# Altium schematic sheet PlacaBase_agus.SchDoc
size B; PageSetup: Record=PageOptions|CenterHorizontal=True|CenterVertical=True|PrintScale=1.00|XCorrection=1.00|YCorrection=1.00|PrintKind=1|BorderSize=5000000|LeftOffset=0|BottomOffset=0|Orientation=2|PaperLength=1000|PaperWidth=1000|Scale=100|PaperSource=7|PrintQuality=-4|MediaType=1|DitherType=10|PaperKind=A4|PrintScaleMode=1
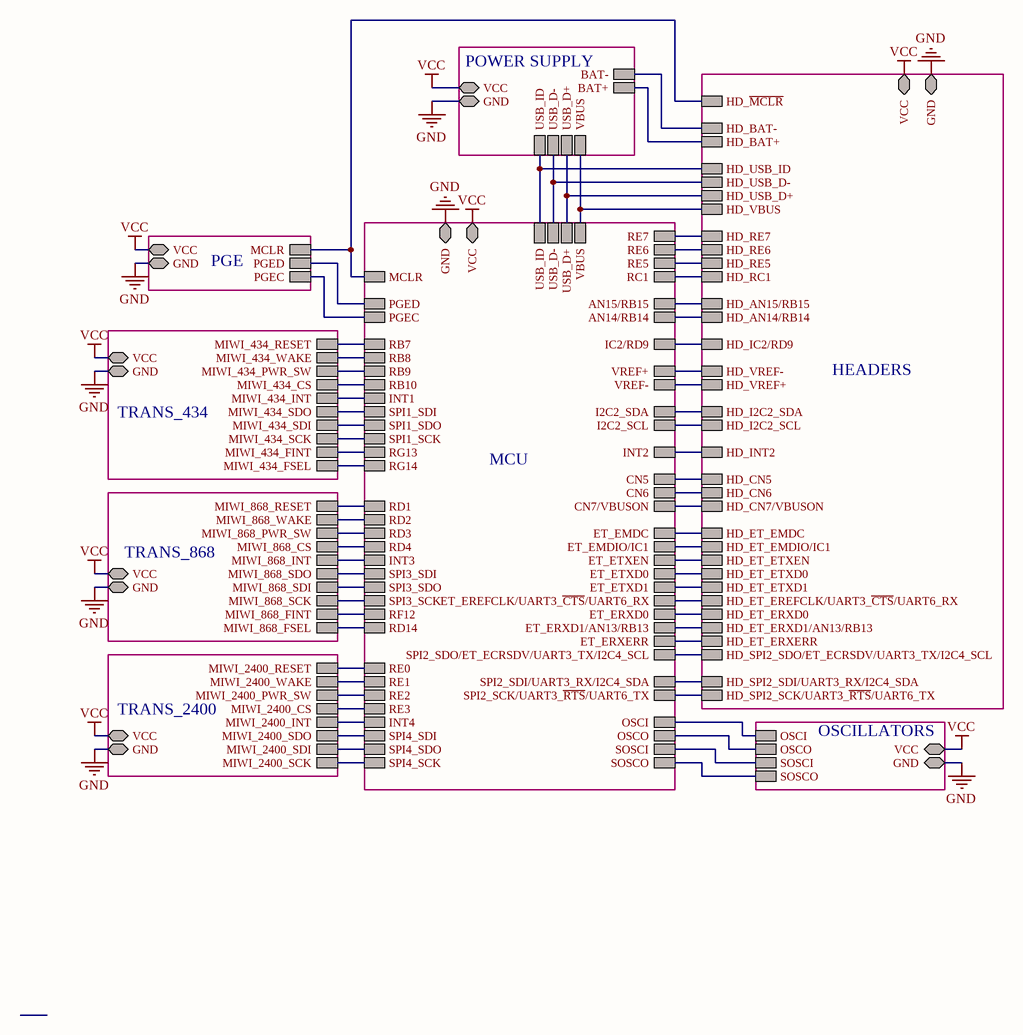
[diagram p0: PlacaBase_agus.SchDoc]

## Sub-sheets
HEADERS = headers.SchDoc: HD_RE5, HD_RE6, HD_RE7, HD_RC1, HD_AN15/RB15, HD_AN14/RB14, HD_INT2, HD_VREF+, HD_VREF-, HD_I2C2_SDA, HD_I2C2_SCL, HD_BAT+, HD_~{MCLR}, HD_CN6, HD_CN5, HD_CN7/VBUSON, HD_IC2/RD9, HD_BAT-, HD_USB_ID, HD_USB_D+, HD_USB_D-, HD_VBUS, HD_ET_EMDC, HD_ET_ETXEN, HD_ET_ETXD0, HD_ET_ETXD1, HD_ET_ERXD0, HD_ET_ERXERR, HD_SPI2_SCK/UART3_~{RTS}/UART6_TX, HD_SPI2_SDI/UART3_RX/I2C4_SDA, HD_SPI2_SDO/ET_ECRSDV/UART3_TX/I2C4_SCL, HD_ET_EREFCLK/UART3_~{CTS}/UART6_RX, HD_ET_EMDIO/IC1, HD_ET_ERXD1/AN13/RB13, VCC, GND
MCU = MCU.SchDoc: VBUS, PGED, PGEC, MCLR, SPI4_SDI, SPI4_SDO, SPI4_SCK, SPI1_SDO, SPI1_SDI, SPI1_SCK, SPI3_SCK, SPI3_SDI, SPI3_SDO, USB_ID, USB_D-, USB_D+, OSCI, OSCO, SOSCI, SOSCO, RE0, RE1, RE3, RB7, RD1, RB8, RD2, RB9, RD3, INT3, INT1, INT2, RB10, RD4, RE2, INT4, RE7, RE6, RE5, RC1, VREF-, VREF+, AN15/RB15, AN14/RB14, ET_ERXD1/AN13/RB13, I2C2_SCL, I2C2_SDA, CN7/VBUSON, CN6, CN5, ET_EMDIO/IC1, IC2/RD9, SPI2_SCK/UART3_~{RTS}/UART6_TX, SPI2_SDI/UART3_RX/I2C4_SDA, SPI2_SDO/ET_ECRSDV/UART3_TX/I2C4_SCL, ET_EREFCLK/UART3_~{CTS}/UART6_RX, ET_EMDC, ET_ETXEN, ET_ETXD0, ET_ETXD1, ET_ERXD0, ET_ERXERR, GND, VCC, RD14, RF12, RG13, RG14
OSCILLATORS = oscillators.SchDoc: OSCI, OSCO, SOSCI, SOSCO, VCC, GND
PGE = PGE.SchDoc: MCLR, PGED, PGEC, VCC, GND
POWER SUPPLY = power_supply.SchDoc: USB_ID, USB_D-, USB_D+, VBUS, BAT-, BAT+, GND, VCC
TRANS_434 = transc_MIWI434.SchDoc: MIWI_434_RESET, MIWI_434_WAKE, MIWI_434_INT, MIWI_434_SDI, MIWI_434_SCK, MIWI_434_CS, MIWI_434_SDO, MIWI_434_PWR_SW, VCC, GND, MIWI_434_FINT, MIWI_434_FSEL
TRANS_868 = transc_MIWI868.SchDoc: MIWI_868_RESET, MIWI_868_WAKE, MIWI_868_INT, MIWI_868_SDI, MIWI_868_SCK, MIWI_868_CS, MIWI_868_SDO, MIWI_868_PWR_SW, VCC, GND, MIWI_868_FINT, MIWI_868_FSEL
TRANS_2400 = transc_MIWI2400.SchDoc: MIWI_2400_RESET, MIWI_2400_WAKE, MIWI_2400_INT, MIWI_2400_SDI, MIWI_2400_SCK, MIWI_2400_CS, MIWI_2400_SDO, MIWI_2400_PWR_SW, VCC, GND

## Nets
GND: sheet PGE/GND, sheet OSCILLATORS/GND, sheet HEADERS/GND, sheet TRANS_434/GND, sheet TRANS_868/GND, sheet TRANS_2400/GND, sheet POWER SUPPLY/GND, sheet MCU/GND
VCC: sheet PGE/VCC, sheet OSCILLATORS/VCC, sheet HEADERS/VCC, sheet TRANS_434/VCC, sheet TRANS_868/VCC, sheet TRANS_2400/VCC, sheet POWER SUPPLY/VCC, sheet MCU/VCC
(unnamed): sheet PGE/MCLR, sheet HEADERS/HD_~{MCLR}, sheet MCU/MCLR
(unnamed): sheet PGE/PGED, sheet MCU/PGED
(unnamed): sheet PGE/PGEC, sheet MCU/PGEC
(unnamed): sheet OSCILLATORS/OSCI, sheet MCU/OSCI
(unnamed): sheet OSCILLATORS/OSCO, sheet MCU/OSCO
(unnamed): sheet OSCILLATORS/SOSCI, sheet MCU/SOSCI
(unnamed): sheet OSCILLATORS/SOSCO, sheet MCU/SOSCO
(unnamed): sheet HEADERS/HD_RE5, sheet MCU/RE5
(unnamed): sheet HEADERS/HD_RE6, sheet MCU/RE6
(unnamed): sheet HEADERS/HD_RE7, sheet MCU/RE7
(unnamed): sheet HEADERS/HD_RC1, sheet MCU/RC1
(unnamed): sheet HEADERS/HD_AN15/RB15, sheet MCU/AN15/RB15
(unnamed): sheet HEADERS/HD_AN14/RB14, sheet MCU/AN14/RB14
(unnamed): sheet HEADERS/HD_INT2, sheet MCU/INT2
(unnamed): sheet HEADERS/HD_VREF+, sheet MCU/VREF-
(unnamed): sheet HEADERS/HD_VREF-, sheet MCU/VREF+
(unnamed): sheet HEADERS/HD_I2C2_SDA, sheet MCU/I2C2_SDA
(unnamed): sheet HEADERS/HD_I2C2_SCL, sheet MCU/I2C2_SCL
(unnamed): sheet HEADERS/HD_BAT+, sheet POWER SUPPLY/BAT+
(unnamed): sheet HEADERS/HD_CN6, sheet MCU/CN6
(unnamed): sheet HEADERS/HD_CN5, sheet MCU/CN5
(unnamed): sheet HEADERS/HD_CN7/VBUSON, sheet MCU/CN7/VBUSON
(unnamed): sheet HEADERS/HD_IC2/RD9, sheet MCU/IC2/RD9
(unnamed): sheet HEADERS/HD_BAT-, sheet POWER SUPPLY/BAT-
(unnamed): sheet HEADERS/HD_USB_ID, sheet POWER SUPPLY/USB_ID, sheet MCU/USB_ID
(unnamed): sheet HEADERS/HD_USB_D+, sheet POWER SUPPLY/USB_D+, sheet MCU/USB_D+
(unnamed): sheet HEADERS/HD_USB_D-, sheet POWER SUPPLY/USB_D-, sheet MCU/USB_D-
(unnamed): sheet HEADERS/HD_VBUS, sheet POWER SUPPLY/VBUS, sheet MCU/VBUS
(unnamed): sheet HEADERS/HD_ET_EMDC, sheet MCU/ET_EMDC
(unnamed): sheet HEADERS/HD_ET_ETXEN, sheet MCU/ET_ETXEN
(unnamed): sheet HEADERS/HD_ET_ETXD0, sheet MCU/ET_ETXD0
(unnamed): sheet HEADERS/HD_ET_ETXD1, sheet MCU/ET_ETXD1
(unnamed): sheet HEADERS/HD_ET_ERXD0, sheet MCU/ET_ERXD0
(unnamed): sheet HEADERS/HD_ET_ERXERR, sheet MCU/ET_ERXERR
(unnamed): sheet HEADERS/HD_SPI2_SCK/UART3_~{RTS}/UART6_TX, sheet MCU/SPI2_SCK/UART3_~{RTS}/UART6_TX
(unnamed): sheet HEADERS/HD_SPI2_SDI/UART3_RX/I2C4_SDA, sheet MCU/SPI2_SDI/UART3_RX/I2C4_SDA
(unnamed): sheet HEADERS/HD_SPI2_SDO/ET_ECRSDV/UART3_TX/I2C4_SCL, sheet MCU/SPI2_SDO/ET_ECRSDV/UART3_TX/I2C4_SCL
(unnamed): sheet HEADERS/HD_ET_EREFCLK/UART3_~{CTS}/UART6_RX, sheet MCU/ET_EREFCLK/UART3_~{CTS}/UART6_RX
(unnamed): sheet HEADERS/HD_ET_EMDIO/IC1, sheet MCU/ET_EMDIO/IC1
(unnamed): sheet HEADERS/HD_ET_ERXD1/AN13/RB13, sheet MCU/ET_ERXD1/AN13/RB13
(unnamed): sheet TRANS_434/MIWI_434_RESET, sheet MCU/RB7
(unnamed): sheet TRANS_434/MIWI_434_WAKE, sheet MCU/RB8
(unnamed): sheet TRANS_434/MIWI_434_INT, sheet MCU/INT1
(unnamed): sheet TRANS_434/MIWI_434_SDI, sheet MCU/SPI1_SDO
(unnamed): sheet TRANS_434/MIWI_434_SCK, sheet MCU/SPI1_SCK
(unnamed): sheet TRANS_434/MIWI_434_CS, sheet MCU/RB10
(unnamed): sheet TRANS_434/MIWI_434_SDO, sheet MCU/SPI1_SDI
(unnamed): sheet TRANS_434/MIWI_434_PWR_SW, sheet MCU/RB9
(unnamed): sheet TRANS_434/MIWI_434_FINT, sheet MCU/RG13
(unnamed): sheet TRANS_434/MIWI_434_FSEL, sheet MCU/RG14
(unnamed): sheet TRANS_868/MIWI_868_RESET, sheet MCU/RD1
(unnamed): sheet TRANS_868/MIWI_868_WAKE, sheet MCU/RD2
(unnamed): sheet TRANS_868/MIWI_868_INT, sheet MCU/INT3
(unnamed): sheet TRANS_868/MIWI_868_SDI, sheet MCU/SPI3_SDO
(unnamed): sheet TRANS_868/MIWI_868_SCK, sheet MCU/SPI3_SCK
(unnamed): sheet TRANS_868/MIWI_868_CS, sheet MCU/RD4
(unnamed): sheet TRANS_868/MIWI_868_SDO, sheet MCU/SPI3_SDI
(unnamed): sheet TRANS_868/MIWI_868_PWR_SW, sheet MCU/RD3
(unnamed): sheet TRANS_868/MIWI_868_FINT, sheet MCU/RF12
(unnamed): sheet TRANS_868/MIWI_868_FSEL, sheet MCU/RD14
(unnamed): sheet TRANS_2400/MIWI_2400_RESET, sheet MCU/RE0
(unnamed): sheet TRANS_2400/MIWI_2400_WAKE, sheet MCU/RE1
(unnamed): sheet TRANS_2400/MIWI_2400_INT, sheet MCU/INT4
(unnamed): sheet TRANS_2400/MIWI_2400_SDI, sheet MCU/SPI4_SDO
(unnamed): sheet TRANS_2400/MIWI_2400_SCK, sheet MCU/SPI4_SCK
(unnamed): sheet TRANS_2400/MIWI_2400_CS, sheet MCU/RE3
(unnamed): sheet TRANS_2400/MIWI_2400_SDO, sheet MCU/SPI4_SDI
(unnamed): sheet TRANS_2400/MIWI_2400_PWR_SW, sheet MCU/RE2